# Altium schematic sheet FPGA_main.SchDoc: FPGA Peripherals Board - Main
size A3; Author: mayerph; DrawnBy: mayerph; Organization: IIS; Revision: PA; SheetNumber: 1; SheetTotal: 7
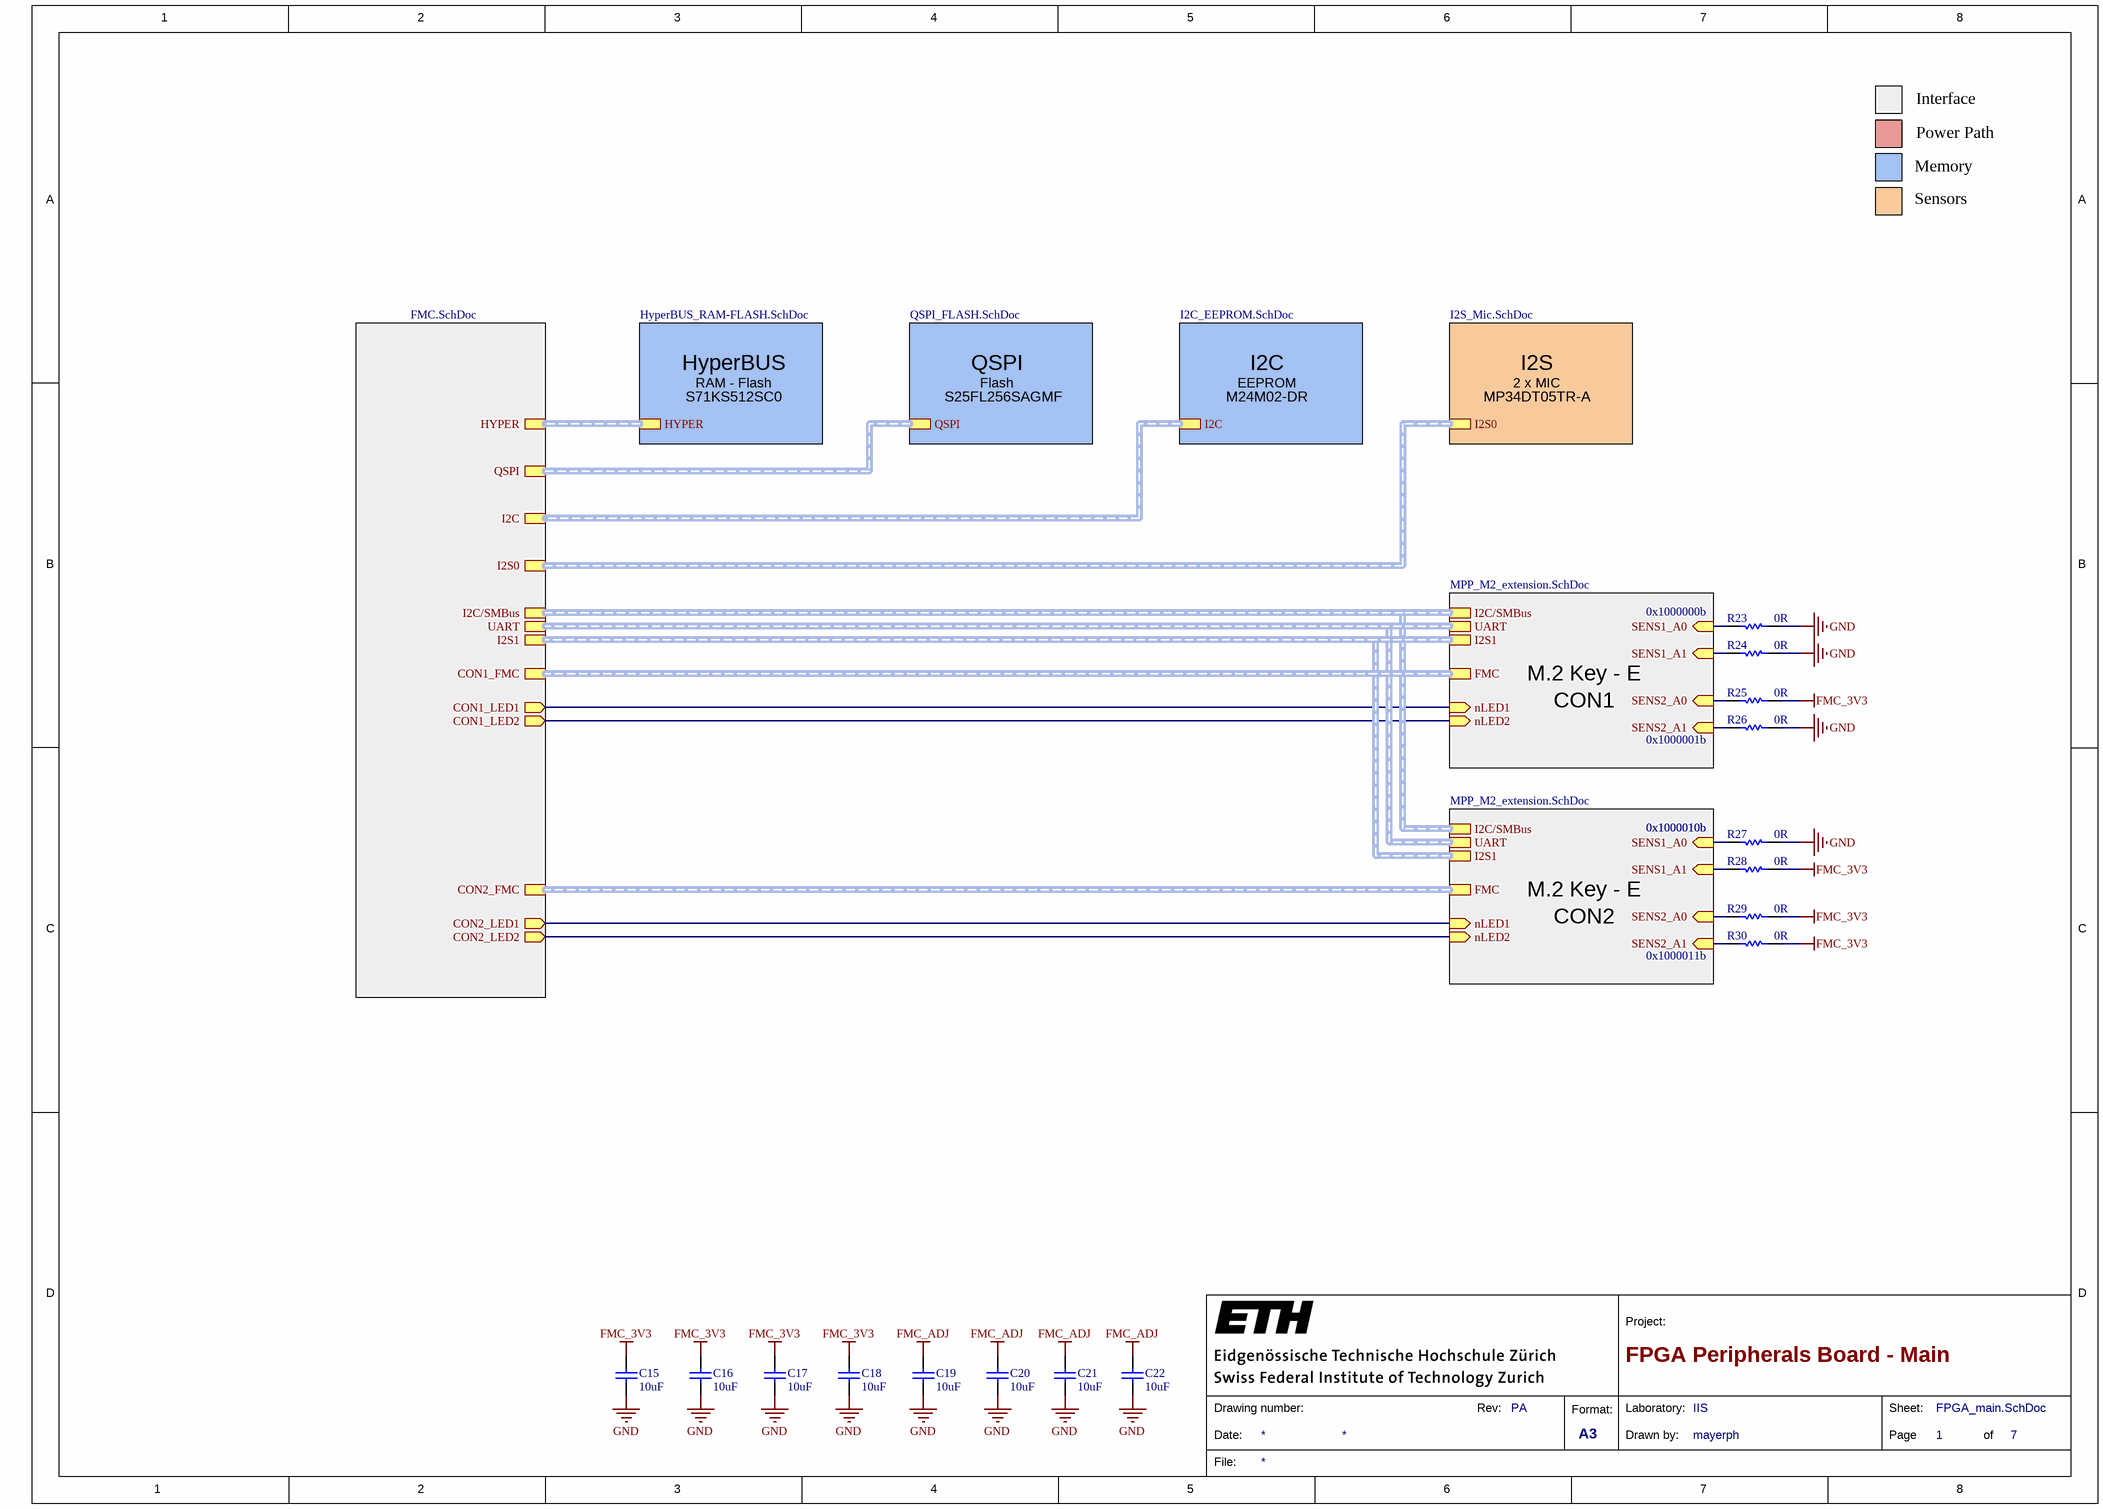
[diagram p0: FPGA_main.SchDoc]

## Parts
C15  10uF  [CAPC1608X90X35LL15T15]
C16  10uF  [CAPC1608X90X35LL15T15]
C17  10uF  [CAPC1608X90X35LL15T15]
C18  10uF  [CAPC1608X90X35LL15T15]
C19  10uF  [CAPC1608X90X35LL15T15]
C20  10uF  [CAPC1608X90X35LL15T15]
C21  10uF  [CAPC1608X90X35LL15T15]
C22  10uF  [CAPC1608X90X35LL15T15]
R23  0R  [RESC1005X40X25LL05T10]
R24  0R  [RESC1005X40X25LL05T10]
R25  0R  [RESC1005X40X25LL05T10]
R26  0R  [RESC1005X40X25LL05T10]
R27  0R  [RESC1005X40X25LL05T10]
R28  0R  [RESC1005X40X25LL05T10]
R29  0R  [RESC1005X40X25LL05T10]
R30  0R  [RESC1005X40X25LL05T10]

## Sub-sheets
CON1 = MPP_M2_extension.SchDoc: FMC (harness FMC), I2S1 (harness I2S), nLED1 (in), I2C/SMBus (harness I2C/SMBus), UART (harness UART), nLED2 (in), SENS2_A0 (in), SENS1_A1 (in), SENS2_A1 (in), SENS1_A0 (in)
CON2 = MPP_M2_extension.SchDoc: FMC (harness FMC), I2S1 (harness I2S), nLED1 (in), I2C/SMBus (harness I2C/SMBus), UART (harness UART), nLED2 (in), SENS2_A0 (in), SENS1_A1 (in), SENS2_A1 (in), SENS1_A0 (in)
FMC = FMC.SchDoc: HYPER, QSPI, I2C, I2S0, I2C/SMBus, UART, I2S1, CON1_FMC, CON2_FMC, CON1_LED1 (out), CON1_LED2 (out), CON2_LED1 (out), CON2_LED2 (out)
HYPER = HyperBUS_RAM-FLASH.SchDoc: HYPER (harness HYPER)
I2C = I2C_EEPROM.SchDoc: I2C (harness I2C0)
I2S = I2S_Mic.SchDoc: I2S0 (harness I2S0)
QSPI = QSPI_FLASH.SchDoc: QSPI (harness QSPI0)

## Nets
FMC_3V3: C15.2 C16.2 C17.2 C18.2 R25.1 R28.1 R29.1 R30.1
FMC_ADJ: C19.2 C20.2 C21.2 C22.2
GND: C15.1 C16.1 C17.1 C18.1 C19.1 C20.1 C21.1 C22.1 R23.1 R24.1 R26.1 R27.1
NetR23_2: R23.2 ; sheet CON1/SENS1_A0
NetR24_2: R24.2 ; sheet CON1/SENS1_A1
NetR25_2: R25.2 ; sheet CON1/SENS2_A0
NetR26_2: R26.2 ; sheet CON1/SENS2_A1
NetR27_2: R27.2 ; sheet CON2/SENS1_A0
NetR28_2: R28.2 ; sheet CON2/SENS1_A1
NetR29_2: R29.2 ; sheet CON2/SENS2_A0
NetR30_2: R30.2 ; sheet CON2/SENS2_A1
(unnamed): sheet FMC/CON1_LED1, sheet CON1/nLED1
(unnamed): sheet FMC/CON1_LED2, sheet CON1/nLED2
(unnamed): sheet FMC/CON2_LED1, sheet CON2/nLED1
(unnamed): sheet FMC/CON2_LED2, sheet CON2/nLED2

## Buses and harness runs
harness sheet CON1/FMC = sheet FMC/CON1_FMC
harness sheet CON1/I2C/SMBus = sheet CON2/I2C/SMBus = sheet FMC/I2C/SMBus
harness sheet CON1/I2S1 = sheet CON2/I2S1 = sheet FMC/I2S1
harness sheet CON1/UART = sheet CON2/UART = sheet FMC/UART
harness sheet CON2/FMC = sheet FMC/CON2_FMC
harness sheet FMC/HYPER = sheet HYPER/HYPER
harness sheet FMC/I2C = sheet I2C/I2C
harness sheet FMC/I2S0 = sheet I2S/I2S0
harness sheet FMC/QSPI = sheet QSPI/QSPI

## Notes on the sheet
- Interface
- Memory
- Power Path
- Sensors
- HyperBUS
- RAM - Flash
- QSPI
- Flash
- I2C
- EEPROM
- I2S
- 2 x MIC
- S71KS512SC0
- S25FL256SAGMF
- M24M02-DR
- MP34DT05TR-A
- 0x1000000b
- M.2 Key - E
- CON1
- 0x1000001b
- 0x1000010b
- CON2
- 0x1000011b
- 1
- 2
- 3
- 4
- 5
- 6
- 7
- 8
- A
- B
- C
- D
- Project:
- Date:
- Drawing number:
- Rev:
- Format:
- A3
- Drawn by:
- Laboratory:
- Page
- Sheet:
- of
- File:

## Library data of the parts
C15-C22 = CMP-2006-04476-1: Manufacturer: AVX Interconnect / Elco; Part Number: 06036D106MAT2A; Dielectric Material: Ceramic; Tolerance: 20%; Voltage Rating: 6.3V; Dielectric: X5R; Supplier 1: Digi-Key; Supplier Part Number 1: 478-5318-1-ND; Manufacturer Part Number: 06036D106MAT2A; RoHS: Yes; Category: Ceramic Capacitors; Stock 1: 1934840; Pricing 1: 1=0.24000, 10=0.16500, 50=0.09900, 100=0.08360, 500=0.05720, 1000=0.05060 (USD); Mount: Surface Mount,PCB; Case/Package: 0603; Number of Pins: 2; Case Code (Metric): 1608; Case Code (Imperial): 0603; Contact Plating: Tin,Matte; Min Operating Temperature: -55°C; Max Operating Temperature: 85°C; Value: 10uF; Packaging: Tape and Reel; Package Quantity: 1; Voltage Rating (DC): 6.3V; Termination: SMD/SMT; Series: -; Construction: Flat; Voltage: 6.3V; Length: 1.6mm; Width: 0.032inch; Height: 0.9mm; Thickness: 0.035inch; Depth: 0.81mm; Radiation Hardening: No; RoHS Compliant: Yes; Lead Free: Lead Free; REACH SVHC: No SVHC; ComponentLink1URL: https://datasheet.ciiva.com/153/cx5r-153301.pdf?src-supplier=Digi-Key; ComponentLink1Description: https://datasheet.ciiva.com/153/cx5r-153301.pdf?src-supplier=Digi-Key; ComponentLink2URL: https://datasheet.ciiva.com/1458/1796776-1458117.pdf?src-supplier=Element14; ComponentLink2Description: https://datasheet.ciiva.com/1458/1796776-1458117.pdf?src-supplier=Element14; ComponentLink3URL: https://datasheet.ciiva.com/153/cx5r-153302.pdf?src-supplier=Digi-Key; ComponentLink3Description: https://datasheet.ciiva.com/153/cx5r-153302.pdf?src-supplier=Digi-Key; ComponentLink4URL: https://datasheet.ciiva.com/153/cx5r-153303.pdf?src-supplier=Digi-Key; ComponentLink4Description: https://datasheet.ciiva.com/153/cx5r-153303.pdf?src-supplier=Digi-Key; ComponentLink5URL: https://datasheet.ciiva.com/5422/cx5r-33896-5422935.pdf?src-supplier=Mouser; ComponentLink5Description: https://datasheet.ciiva.com/5422/cx5r-33896-5422935.pdf?src-supplier=Mouser; ComponentLink6URL: https://datasheet.ciiva.com/16538/cx5r-16538025.pdf?src-supplier=Avnet+Asia; ComponentLink6Description: https://datasheet.ciiva.com/16538/cx5r-16538025.pdf?src-supplier=Avnet+Asia; ComponentLink7URL: https://datasheet.ciiva.com/2987/cx5r-2987866.pdf?src-supplier=Avnet; ComponentLink7Description: https://datasheet.ciiva.com/2987/cx5r-2987866.pdf?src-supplier=Avnet; ComponentLink8URL: https://datasheet.ciiva.com/14591/70001028-14591754.pdf?src-supplier=Allied+Electronics; ComponentLink8Description: https://datasheet.ciiva.com/14591/70001028-14591754.pdf?src-supplier=Allied+Electronics; ComponentLink9URL: https://datasheet.ciiva.com/2987/cx5r-2987867.pdf?src-supplier=Avnet; ComponentLink9Description: https://datasheet.ciiva.com/2987/cx5r-2987867.pdf?src-supplier=Avnet; ComponentLink10URL: https://datasheet.ciiva.com/16201/cx5r-16201627.pdf?src-supplier=Future+Electronics; ComponentLink10Description: https://datasheet.ciiva.com/16201/cx5r-16201627.pdf?src-supplier=Future+Electronics
R23-R30 = CMP-2002-07912-1: Manufacturer: Yageo; Part Number: RC0402JR-070RL; Value: 0 Ohm; Power Rating: 62.5mW; Tolerance: 5%; Voltage Rating: 50V; Temperature Coefficient: 200ppm/°C; Max Power Dissipation: 63mW; Supplier 1: Digi-Key; Supplier Part Number 1: 311-0.0JRCT-ND; Manufacturer Part Number: RC0402JR-070RL; RoHS: Yes; Category: Chip SMD Resistors; Stock 1: 44193294; Pricing 1: 1=0.10000, 10=0.01200, 25=0.00840, 50=0.00640, 100=0.00480, 250=0.00364, 500=0.00292, 1000=0.00215, 5000=0.00154 (USD); Case/Package: 0402; Contact Plating: Tin,Matte; Case Code (Metric): 1005; Case Code (Imperial): 0402; Min Operating Temperature: -55°C; Max Operating Temperature: 155°C; Resistor Type: Thick Film; Packaging: Tape and Reel; Termination: SMD/SMT; Package Quantity: 1; Number of Terminations: 2; Features: Moisture Resistant; Length: 1mm; Height: 0.016inch; Width: 0.02inch; Depth: 0.5mm; Radiation Hardening: No; Lead Free: Lead Free; REACH SVHC: Unknown; Military Standard: Not; ComponentLink1URL: https://datasheet.ciiva.com/2452/pyu-rc0402-51-rohs-l-6-2452608.pdf?src-supplier=Digi-Key; ComponentLink1Description: https://datasheet.ciiva.com/2452/pyu-rc0402-51-rohs-l-6-2452608.pdf?src-supplier=Digi-Key; ComponentLink2URL: https://datasheet.ciiva.com/11808/0900766b80c66297-11808195.pdf?src-supplier=RSComponents; ComponentLink2Description: https://datasheet.ciiva.com/11808/0900766b80c66297-11808195.pdf?src-supplier=RSComponents; ComponentLink3URL: https://datasheet.ciiva.com/2452/pyu-r-int-thick-7-2452609.pdf?src-supplier=Digi-Key; ComponentLink3Description: https://datasheet.ciiva.com/2452/pyu-r-int-thick-7-2452609.pdf?src-supplier=Digi-Key; ComponentLink4URL: https://datasheet.ciiva.com/2452/pyu-r-int-thick-7-2452610.pdf?src-supplier=Digi-Key; ComponentLink4Description: https://datasheet.ciiva.com/2452/pyu-r-int-thick-7-2452610.pdf?src-supplier=Digi-Key; ComponentLink5URL: https://datasheet.ciiva.com/8896/pyu-rc0402-51-rohs-l-6-8896201.pdf?src-supplier=Avnet; ComponentLink5Description: https://datasheet.ciiva.com/8896/pyu-rc0402-51-rohs-l-6-8896201.pdf?src-supplier=Avnet; ComponentLink6URL: https://datasheet.ciiva.com/28386/pyu-rc0402-51-rohs-l-6-28386633.pdf?src-supplier=Avnet+Europe; ComponentLink6Description: https://datasheet.ciiva.com/28386/pyu-rc0402-51-rohs-l-6-28386633.pdf?src-supplier=Avnet+Europe; ComponentLink7URL: https://datasheet.ciiva.com/22747/1018594-22747515.pdf?src-supplier=Element14; ComponentLink7Description: https://datasheet.ciiva.com/22747/1018594-22747515.pdf?src-supplier=Element14; ComponentLink8URL: https://datasheet.ciiva.com/15189/getdatasheetpartid-326379-15189533.pdf?src-supplier=Verical; ComponentLink8Description: https://datasheet.ciiva.com/15189/getdatasheetpartid-326379-15189533.pdf?src-supplier=Verical; ComponentLink9URL: https://datasheet.ciiva.com/7983/1018594-7983535.pdf?src-supplier=Element14; ComponentLink9Description: https://datasheet.ciiva.com/7983/1018594-7983535.pdf?src-supplier=Element14